# Altium project TempDonut.PrjPcb
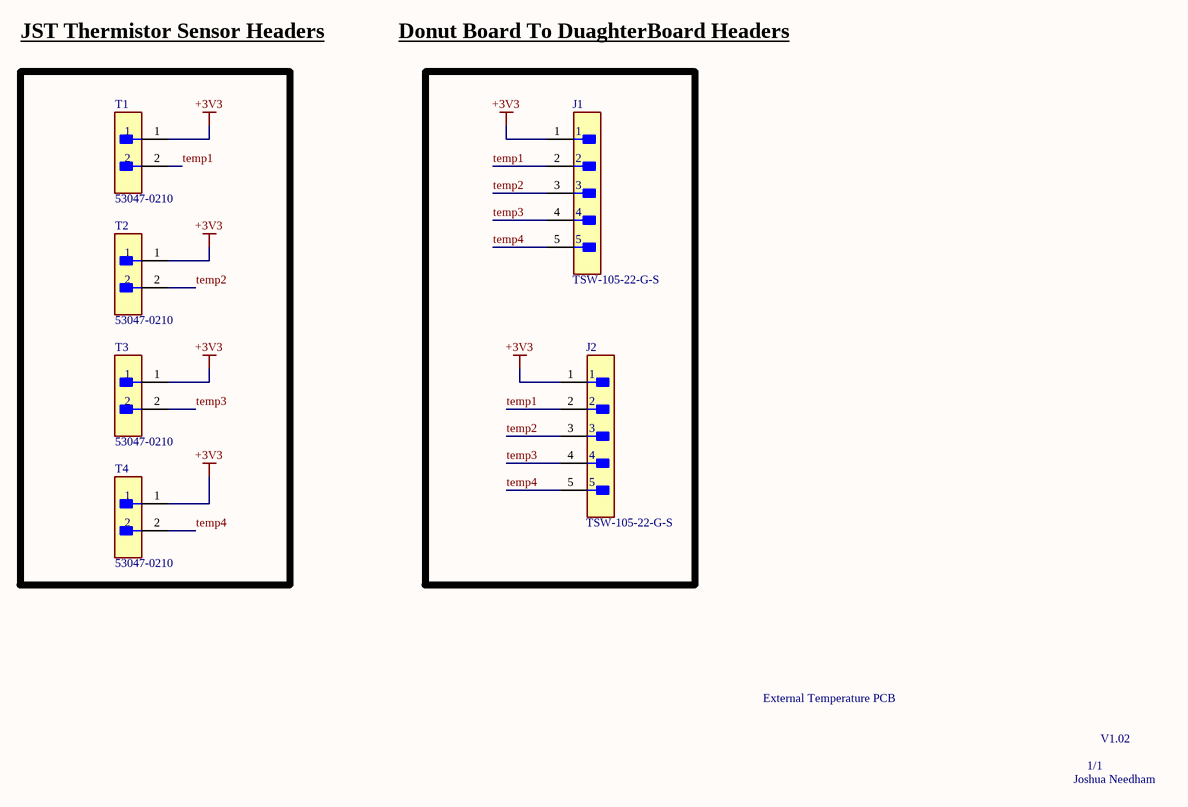
[diagram p0: tempDonut.SchDoc]
1 sheet, 6 parts. Net scope: global (net labels, ports and power ports of the same name join across sheets).
Board files: PCB1.PcbDoc, PCB1.PcbDoc

## Sheet tempDonut.SchDoc
size A4; SheetNumber: 1; SheetTotal: 1

### Parts
J1  TSW-105-22-G-S  [FP-TSW-105-22-G-S-MFG]
J2  TSW-105-22-G-S  [FP-TSW-105-22-G-S-MFG]
T1  53047-0210  [FP-53047-0210-MFG]
T2  53047-0210  [FP-53047-0210-MFG]
T3  53047-0210  [FP-53047-0210-MFG]
T4  53047-0210  [FP-53047-0210-MFG]

### Nets
+3V3: J1.1 J2.1 T1.1 T2.1 T3.1 T4.1
temp1: J1.2 J2.2 T1.2
temp2: J1.3 J2.3 T2.2
temp3: J1.4 J2.4 T3.2
temp4: J1.5 J2.5 T4.2

### Notes on the sheet
- JST Thermistor Sensor Headers
- Donut Board To DuaghterBoard Headers
- External Temperature PCB
- 1/1
- V1.02
- Joshua Needham

### Library data of the parts
J1 J2 = CMP-02766-000105-1: CONN HEADER VERT 5POS 2.54MM; Gender: Male; Number of Contacts: 5; Contact Plating: Gold; Mount: Through Hole; REACH SVHC: No SVHC; Number of Rows: 1; Contact Material: Bronze; Termination: Through Hole
T1-T4 = CMP-2000-05628-3: CONN HEADER VERT 2POS 1.25MM; Manufacturer: Molex; Conn Gender: Male; Voltage Rating: 125V; Conn Orientation: Vertical; Number Of Contacts: 2; Current Rating: 1A; Contact Material: Tin; Temperature Range Low: -40°C; ComponentLink2URL: http://www.molex.com/webdocs/datasheets/pdf/en-us/0530470210_PCB_HEADERS.pdf; Mouser Description: 1.25mm Pitch PicoBlade™ Wire-to-Board Header, Vertical, with Friction Lock, 2 Circuits; Manufacturer Part Number: 53047-0210; Temperature Range High: +85°C; ComponentLink2Description: Datasheet; Automotive: No; RoHS: TRUE; Ambient Temperature Range High: +85°C; Octopart: https://octopart.com/53047-0210-molex-276772; Footprint Url: https://www.molex.com/pdm_docs/sd/530470210_sd.pdf; Lead Free: Yes; Pitch: 1.25mm; Temperature: -40°C to +85°C; Device Class L2: Headers and Wire Housings; Package: 0; Ambient Temperature Range Low: -40°C; Digikey Description: CONN HEADER VERT 2POS 1.25MM; Category: Conn; Device Class L3: unset; Number Of Rows: 1; Device Class L1: Connectors; Height: 4.4mm